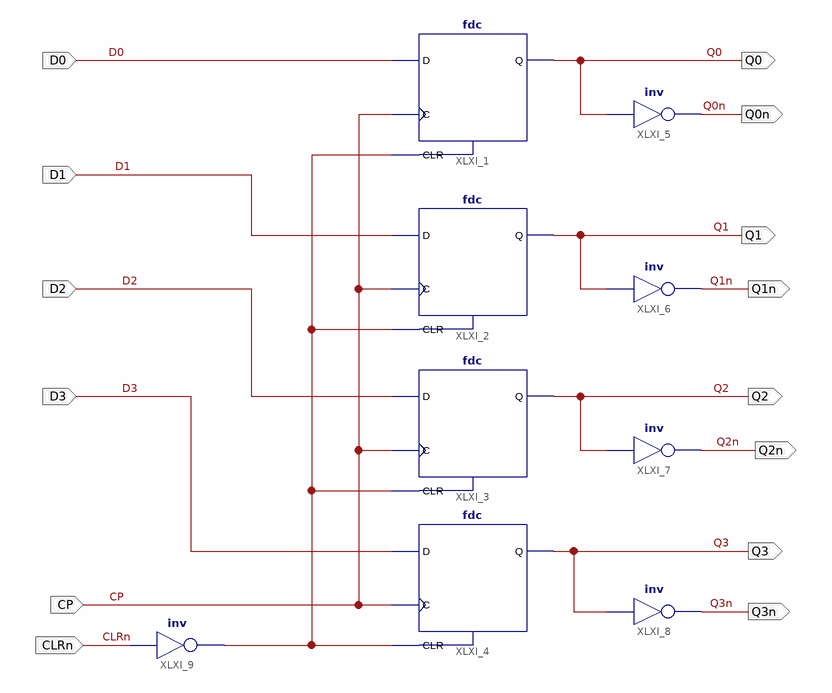
[diagram p0: schematic sheet 1]
// Xilinx ISE schematic chip74LS175.sch (spartan3e) as structural Verilog: 9 symbols, 14 ports
module chip74LS175 (
  input  D0,
  input  D1,
  input  D2,
  input  D3,
  input  CP,
  input  CLRn,
  output Q0,
  output Q0n,
  output Q3,
  output Q2,
  output Q1,
  output Q1n,
  output Q2n,
  output Q3n
);

  wire XLXN_19;

  fdc XLXI_1 (.C(CP), .CLR(XLXN_19), .D(D0), .Q(Q0));
  fdc XLXI_2 (.C(CP), .CLR(XLXN_19), .D(D1), .Q(Q1));
  fdc XLXI_3 (.C(CP), .CLR(XLXN_19), .D(D2), .Q(Q2));
  fdc XLXI_4 (.C(CP), .CLR(XLXN_19), .D(D3), .Q(Q3));
  not XLXI_5 (Q0n, Q0);
  not XLXI_6 (Q1n, Q1);
  not XLXI_7 (Q2n, Q2);
  not XLXI_8 (Q3n, Q3);
  not XLXI_9 (XLXN_19, CLRn);
endmodule
